# Altium schematic sheet 04.SchDoc
size 297 x 209 mm
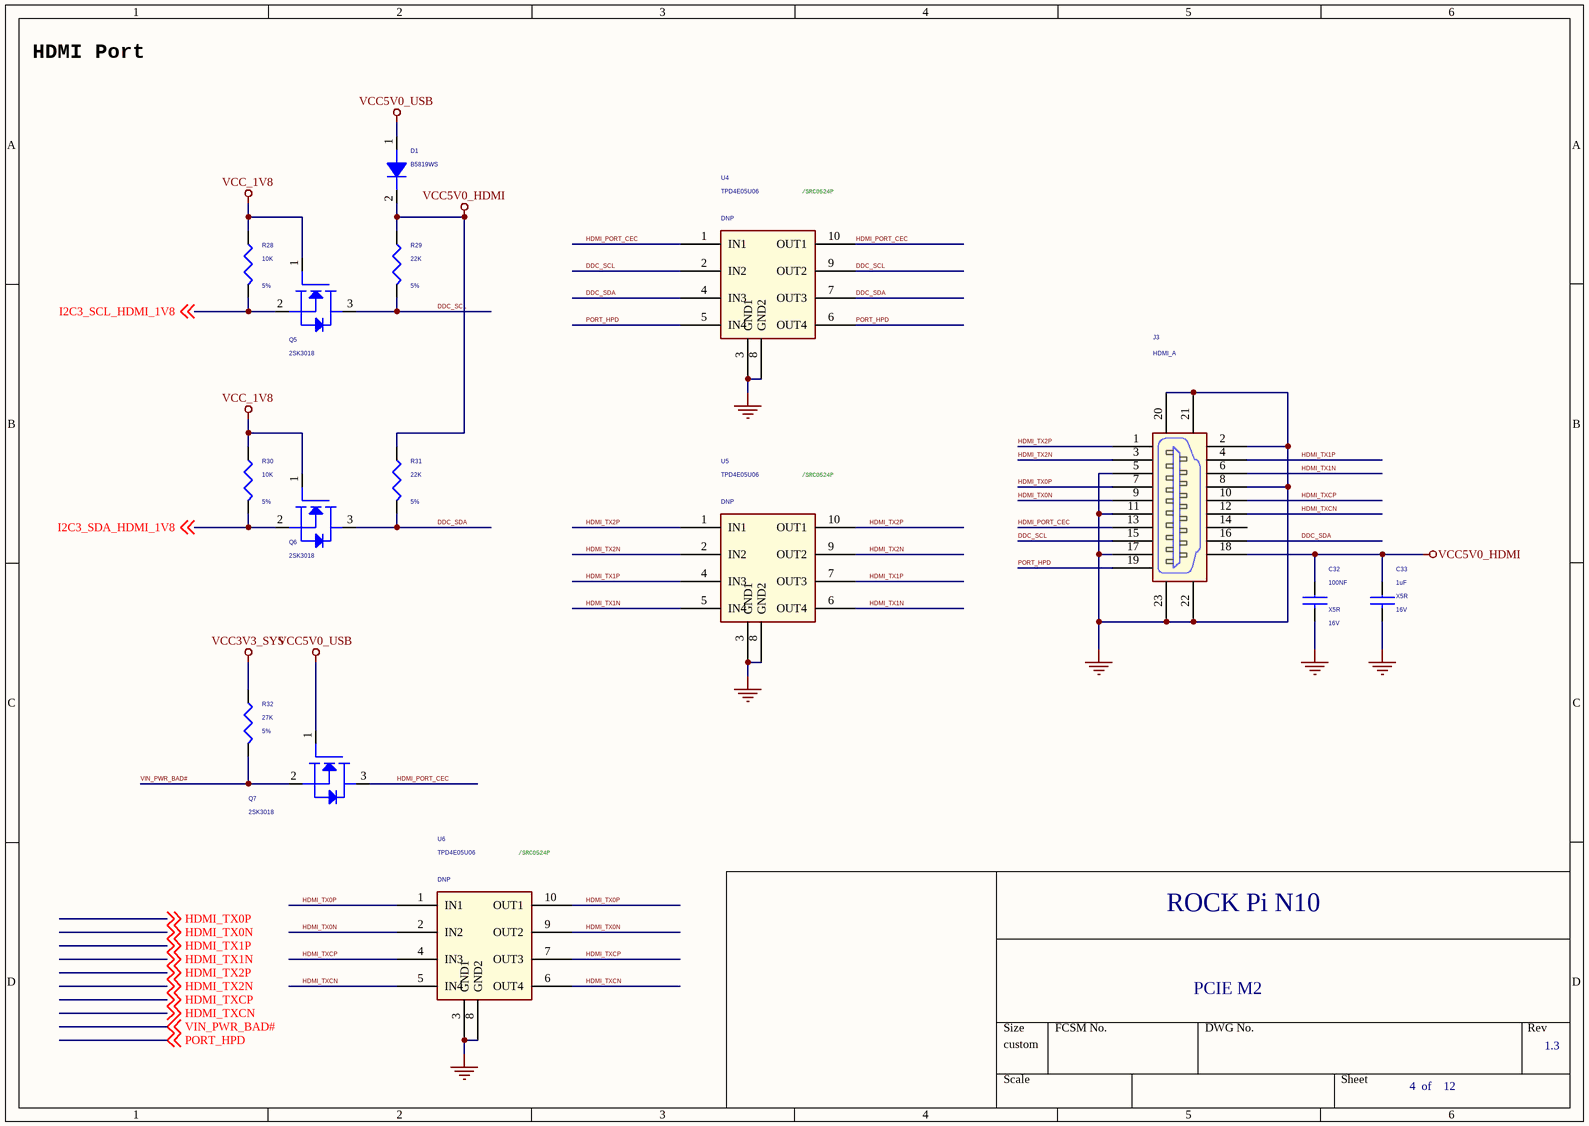
[diagram p0: 04.SchDoc]

## Parts
C32  100NF  Dielectric: X5R  Voltage: 16V  [C0402]
C33  1uF  Dielectric: X5R  Voltage: 16V  [C0402]
D1  B5819WS  [SOD_323]
J3  HDMI_A  [HDMIA19_HDMI_01A]
Q5  2SK3018  [SOT23]
Q6  2SK3018  [SOT23]
Q7  2SK3018  [SOT23]
R28  10K  Tolerance: 5%  [R0402]
R29  22K  Tolerance: 5%  [R0402]
R30  10K  Tolerance: 5%  [R0402]
R31  22K  Tolerance: 5%  [R0402]
R32  27K  Tolerance: 5%  [R0402]
U4  TPD4E05U06  Option: DNP  [SON10_2R50X1R00X0R50]
U5  TPD4E05U06  Option: DNP  [SON10_2R50X1R00X0R50]
U6  TPD4E05U06  Option: DNP  [SON10_2R50X1R00X0R50]

## Nets
GND: C32.2 C33.2 J3.2 J3.5 J3.8 J3.11 J3.17 J3.20 J3.21 J3.22 J3.23 U4.3(GND1) U4.8(GND2) U5.3(GND1) U5.8(GND2) U6.3(GND1) U6.8(GND2)
VCC3V3_SYS: R32.1
VCC5V0_HDMI: C32.1 C33.1 D1.2(K) J3.18 R29.1 R31.1
VCC5V0_USB: D1.1(A) Q7.1(GATE)
VCC_1V8: Q5.1(GATE) Q6.1(GATE) R28.1 R30.1
DDC_SCL: J3.15 Q5.3(DRAIN) R29.2 U4.2(IN2) U4.9(OUT2)
DDC_SDA: J3.16 Q6.3(DRAIN) R31.2 U4.4(IN3) U4.7(OUT3)
HDMI_PORT_CEC: J3.13 Q7.3(DRAIN) U4.1(IN1) U4.10(OUT1)
HDMI_TX0N: J3.9 U6.2(IN2) U6.9(OUT2) ; off-sheet HDMI_TX0N
HDMI_TX0P: J3.7 U6.1(IN1) U6.10(OUT1) ; off-sheet HDMI_TX0P
HDMI_TX1N: J3.6 U5.5(IN4) U5.6(OUT4) ; off-sheet HDMI_TX1N
HDMI_TX1P: J3.4 U5.4(IN3) U5.7(OUT3) ; off-sheet HDMI_TX1P
HDMI_TX2N: J3.3 U5.2(IN2) U5.9(OUT2) ; off-sheet HDMI_TX2N
HDMI_TX2P: J3.1($PIN0) U5.1(IN1) U5.10(OUT1) ; off-sheet HDMI_TX2P
HDMI_TXCN: J3.12 U6.5(IN4) U6.6(OUT4) ; off-sheet HDMI_TXCN
HDMI_TXCP: J3.10 U6.4(IN3) U6.7(OUT3) ; off-sheet HDMI_TXCP
I2C3_SCL_HDMI_1V8: Q5.2(SOURCE) R28.2 ; off-sheet I2C3_SCL_HDMI_1V8
I2C3_SDA_HDMI_1V8: Q6.2(SOURCE) R30.2 ; off-sheet I2C3_SDA_HDMI_1V8
PORT_HPD: J3.19 U4.5(IN4) U4.6(OUT4) ; off-sheet PORT_HPD
VIN_PWR_BAD#: Q7.2(SOURCE) R32.2 ; off-sheet VIN_PWR_BAD#

Not connected (* = marked no-connect by the designer): J3 14

## Notes on the sheet
- HDMI Port
- (near U4) /SRC0524P
- (near U5) /SRC0524P
- (near U6) /SRC0524P
- ROCK Pi N10
- PCIE M2
- 1.3
- 4  of    12

## Library data of the parts
C32 = CAP NP_2: cap,100.00nF,+/-10%,16V,X5R,C0402; Manufacturer: TDK; RK PN: C1005X5R1C104K050BA; Priority: A; Tolerance: 10%; Part Type: C0402; Manufacturer PN: C1005X5R1C104K050BA; Created by: JJJ
C33 = CAP NP_2: cap,1.00uF,+/-10%,16V,X5R,C0402; Manufacturer PN: C1005X5R1C105K050BC; Manufacturer: TDK; Tolerance: 10%; Priority: A; Created by: JJJ; Part Type: C0402; RK PN: C1005X5R1C105K050BC
D1 = DIODE_Dup2: Schottky Barrier，B5819WS SOD-323; Manufacturer: 长电; Priority: A; RK PN: B5819WS; Part Type: Schottky rectifier; Manufacturer PN: B5819WS; Created by: JJJ
J3 = HDMI_A: 通用A型HDMI座,卧式,侧插; Manufacturer: 旺科达; Priority: A; Created by: JJJ; Manufacturer Part Number: HDMI_A; Part Type: HDMI Jack; RK PN: HDMI_A
Q5 Q6 = MOSFET N: NMOS,2SK3018,SOT_323,Id=0.1A,Vds=30V; Manufacturer: ROHM; Rds: 5ohm; Priority: A; Id_max: 0.1A; Vgs: 20V; VDS: 30V; Vgsth: 1.5V; Pd: 0.2W; RK PN: 2SK3018; Part Type: NMOS; Manufacturer PN: 2SK3018; Created by: JJJ
Q7 = MOSFET N: NMOS,2SK3018,SOT_323,Id=0.1A,Vds=30V; Manufacturer: ROHM; Priority: A; Id_max: 0.1A; Vgs: 20V; VDS: 30V; Vgsth: 1.5V; Pd: 0.2W; Rds: 5ohm; RK PN: 2SK3018; Part Type: NMOS; Manufacturer PN: 2SK3018; Created by: JJJ
R28 = RESISTOR_3: 通用厚膜电阻,10K,+/-5%,R0402,1/16W.; Manufacturer: YAGEO; RK PN: RC0402JR-0710KL; Priority: A; Wattage: 1/16W; Part Type: 通用厚膜电阻; Manufacturer PN: RC0402JR-0710KL; Created by: YTL
R29 R31 = RESISTOR_3: 通用厚膜电阻,1K5,+/-5%,R0402,1/16W.; Manufacturer PN: RC0402JR-071K5L; Manufacturer: YAGEO; Wattage: 1/16W; Priority: A; Created by: YTL; Part Type: 通用厚膜电阻; RK PN: RC0402JR-071K5L
R30 = RESISTOR_3: 通用厚膜电阻,10K,+/-5%,R0402,1/16W.; Manufacturer PN: RC0402JR-0710KL; Manufacturer: YAGEO; Wattage: 1/16W; Priority: A; Created by: YTL; Part Type: 通用厚膜电阻; RK PN: RC0402JR-0710KL
R32 = RESISTOR_3: 通用厚膜电阻,27K,+/-5%,R0402,1/16W.; Manufacturer PN: RC0402JR-0727KL; Manufacturer: YAGEO; Wattage: 1/16W; Priority: A; Created by: YTL; Part Type: 通用厚膜电阻; RK PN: RC0402JR-0727KL
U4-U6 = ESD_TPD4E05U06: unidirectional ESD protection devices with ultra low capacitance; Manufacturer: TI（德州仪器）; Priority: A; RK PN: TPD4E05U06; Part Type: ESD_TVS; Manufacturer PN: TPD4E05U06; Created by: JJJ